# Altium schematic sheet [07] - DOC REVISION HISTORY.SchDoc: DWM1003
size A4; DocumentNumber: 7; Revision: v2; SheetNumber: 7; SheetTotal: 7; SheetFunction: Revision history
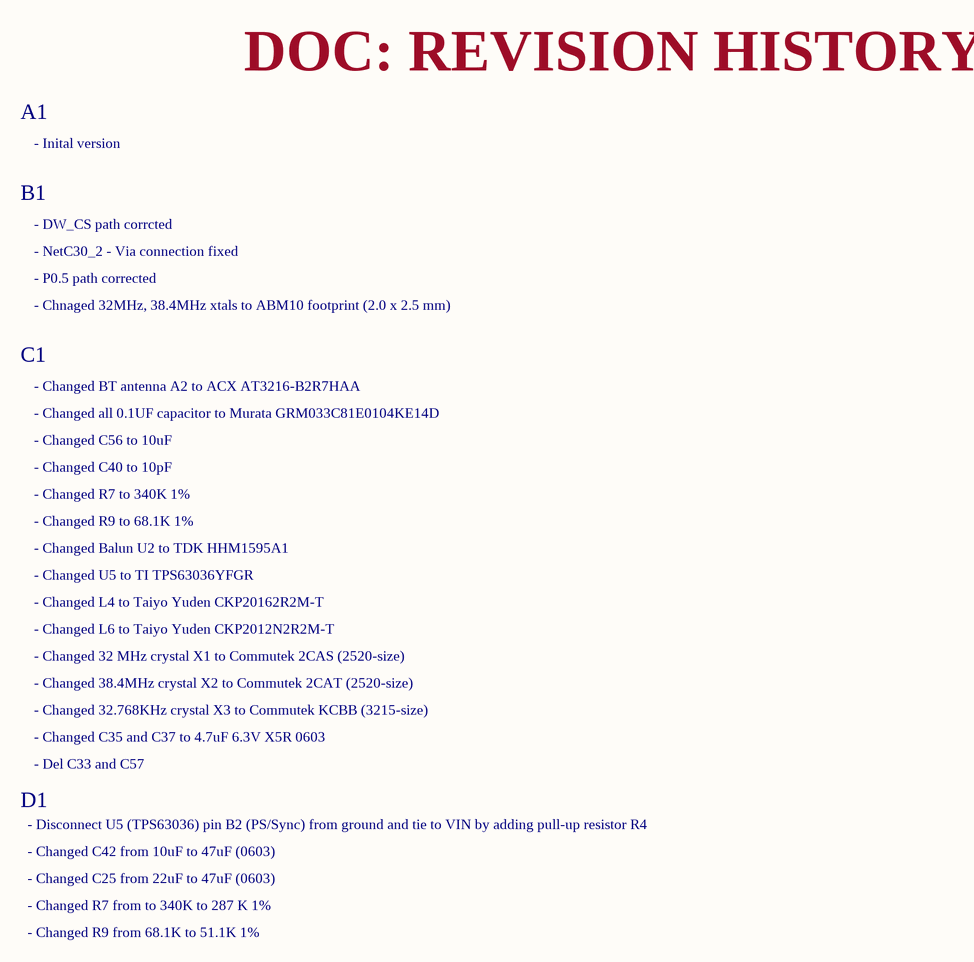
[diagram p0: [07] - DOC REVISION HISTORY.SchDoc]

## Notes on the sheet
- A1
- DOC: REVISION HISTORY
- B1
- - Inital version
- - DW_CS path corrcted
- - NetC30_2 - Via connection fixed
- - P0.5 path corrected
- - Chnaged 32MHz, 38.4MHz xtals to ABM10 footprint (2.0 x 2.5 mm)
- C1
- - Changed BT antenna A2 to ACX AT3216-B2R7HAA
- - Changed all 0.1UF capacitor to Murata GRM033C81E0104KE14D
- - Changed C56 to 10uF
- - Changed C40 to 10pF
- - Changed R7 to 340K 1%
- - Changed R9 to 68.1K 1%
- - Changed Balun U2 to TDK HHM1595A1
- - Changed U5 to TI TPS63036YFGR
- - Changed L4 to Taiyo Yuden CKP20162R2M-T
- - Changed L6 to Taiyo Yuden CKP2012N2R2M-T
- - Changed 32 MHz crystal X1 to Commutek 2CAS (2520-size)
- - Changed 38.4MHz crystal X2 to Commutek 2CAT (2520-size)
- - Changed 32.768KHz crystal X3 to Commutek KCBB (3215-size)
- - Changed C35 and C37 to 4.7uF 6.3V X5R 0603
- D1
- - Del C33 and C57
- - Disconnect U5 (TPS63036) pin B2 (PS/Sync) from ground and tie to VIN by adding pull-up resistor R4
- - Changed C42 from 10uF to 47uF (0603)
- - Changed C25 from 22uF to 47uF (0603)
- CLOCKS (CPU & PCIE)
- - Changed R7 from to 340K to 287 K 1%
- - Changed R9 from 68.1K to 51.1K 1%
- Title:
- Size:
- Date:
- Function:
- A4
- Number:
- Time:
- Revision:
- Sheet
- of
- DecaWave Ltd.
- Adelaide Chambers,
- Peter Street,
- Dublin 8,
- Ireland.
- This document is Decawave's property, it may not be used, transmitted or reproduced without their approval.